# Altium schematic sheet Sheet2.SchDoc: FHGR_A3_landscape
size A3; Date: 18.07.2017; DrawnBy: G.P. Catregn; Organization: HTW Chur; Address1: Pulvermühlestrasse 57; Address2: 7004 Chur; Address3: Switzerland; DocumentNumber: 1; Revision: V1.0; SheetNumber: 2; SheetTotal: 2; DocumentName: HTW Template
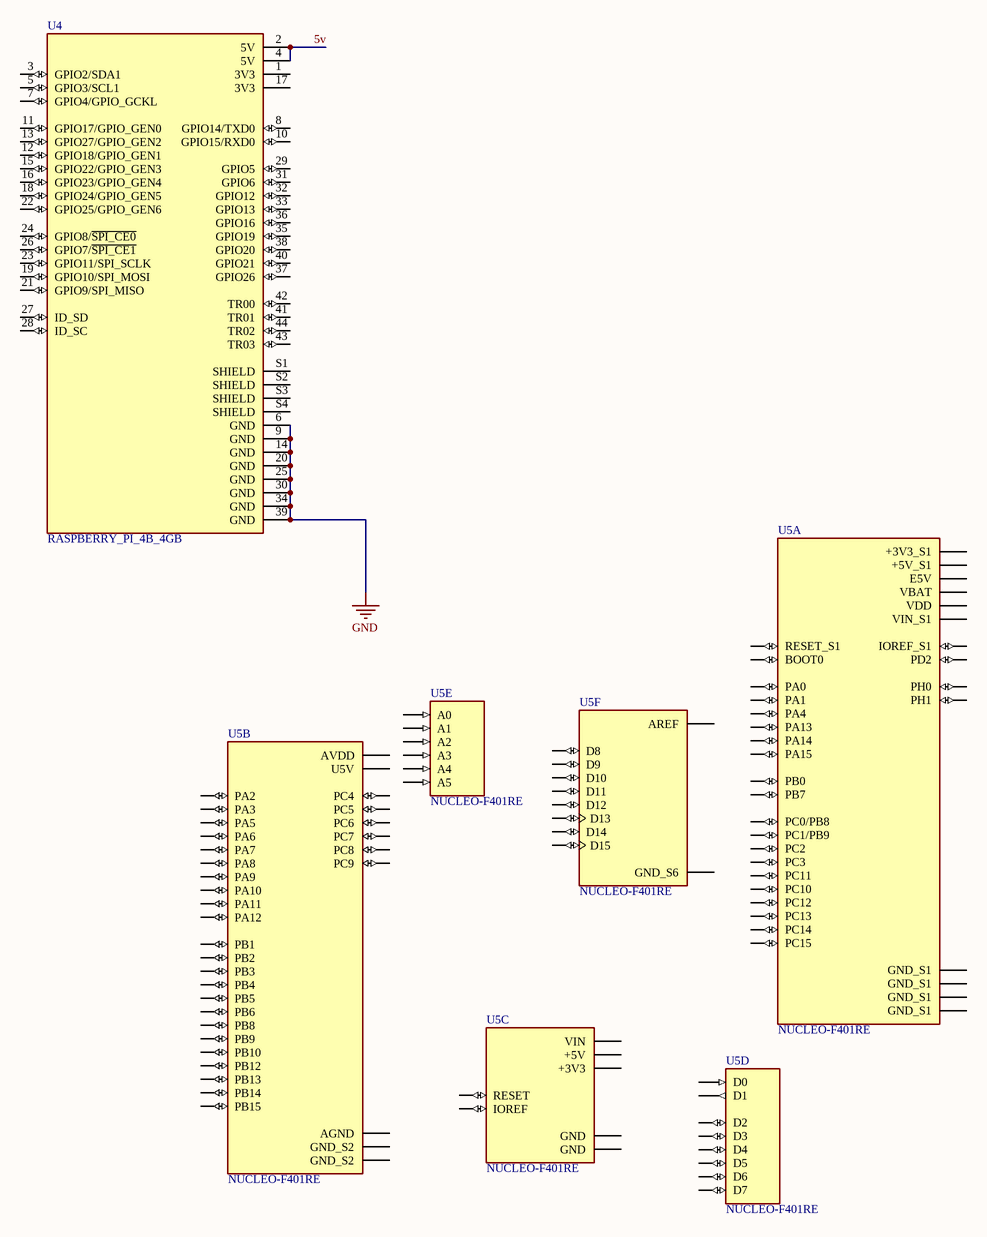
[diagram p0: Sheet2.SchDoc]

## Parts
U4  RASPBERRY_PI_4B_4GB  [MODULE_RASPBERRY_PI_4B_4GB]
U5  NUCLEO-F401RE  [ST_NUCLEO-F401RE]  (parts A,B,C,D,E,F of 6)

## Nets
GND: U4.6(GND) U4.9(GND) U4.14(GND) U4.20(GND) U4.25(GND) U4.30(GND) U4.34(GND) U4.39(GND)
5v: U4.2(5V) U4.4(5V)

Not connected (* = marked no-connect by the designer): U4 1(3V3) 3(GPIO2/SDA1) 5(GPIO3/SCL1) 7(GPIO4/GPIO_GCKL) 8(GPIO14/TXD0) 10(GPIO15/RXD0) 11(GPIO17/GPIO_GEN0) 12(GPIO18/GPIO_GEN1) 13(GPIO27/GPIO_GEN2) 15(GPIO22/GPIO_GEN3) 16(GPIO23/GPIO_GEN4) 17(3V3) 18(GPIO24/GPIO_GEN5) 19(GPIO10/SPI_MOSI) 21(GPIO9/SPI_MISO) 22(GPIO25/GPIO_GEN6) 23(GPIO11/SPI_SCLK) 24(GPIO8/~{SPI_CE0}) 26(GPIO7/~{SPI_CE1}) 27(ID_SD) 28(ID_SC) 29(GPIO5) 31(GPIO6) 32(GPIO12) 33(GPIO13) 35(GPIO19) 36(GPIO16) 37(GPIO26) 38(GPIO20) 40(GPIO21) 41(TR01) 42(TR00) 43(TR03) 44(TR02) S1(SHIELD) S2(SHIELD) S3(SHIELD) S4(SHIELD); U5 CN5_1(D8) CN5_2(D9) CN5_3(D10) CN5_4(D11) CN5_5(D12) CN5_6(D13) CN5_7(GND_S6) CN5_8(AREF) CN5_9(D14) CN5_10(D15) CN6_2(IOREF) CN6_3(RESET) CN6_4(+3V3) CN6_5(+5V) CN6_6(GND) CN6_7(GND) CN6_8(VIN) CN7_1(PC10) CN7_2(PC11) CN7_3(PC12) CN7_4(PD2) CN7_5(VDD) CN7_6(E5V) CN7_7(BOOT0) CN7_8(GND_S1) CN7_12(IOREF_S1) CN7_13(PA13) CN7_14(RESET_S1) CN7_15(PA14) CN7_16(+3V3_S1) CN7_17(PA15) CN7_18(+5V_S1) CN7_19(GND_S1) CN7_20(GND_S1) CN7_21(PB7) CN7_22(GND_S1) CN7_23(PC13) CN7_24(VIN_S1) CN7_25(PC14) CN7_27(PC15) CN7_28(PA0) CN7_29(PH0) CN7_30(PA1) CN7_31(PH1) CN7_32(PA4) CN7_33(VBAT) CN7_34(PB0) CN7_35(PC2) CN7_36(PC1/PB9) CN7_37(PC3) CN7_38(PC0/PB8) CN8_1(A0) CN8_2(A1) CN8_3(A2) CN8_4(A3) CN8_5(A4) CN8_6(A5) CN9_1(D0) CN9_2(D1) CN9_3(D2) CN9_4(D3) CN9_5(D4) CN9_6(D5) CN9_7(D6) CN9_8(D7) CN10_1(PC9) CN10_2(PC8) CN10_3(PB8) CN10_4(PC6) CN10_5(PB9) CN10_6(PC5) CN10_7(AVDD) CN10_8(U5V) CN10_9(GND_S2) CN10_11(PA5) CN10_12(PA12) CN10_13(PA6) CN10_14(PA11) CN10_15(PA7) CN10_16(PB12) CN10_17(PB6) CN10_19(PC7) CN10_20(GND_S2) CN10_21(PA9) CN10_22(PB2) CN10_23(PA8) CN10_24(PB1) CN10_25(PB10) CN10_26(PB15) CN10_27(PB4) CN10_28(PB14) CN10_29(PB5) CN10_30(PB13) CN10_31(PB3) CN10_32(AGND) CN10_33(PA10) CN10_34(PC4) CN10_35(PA2) CN10_37(PA3)

## Notes on the sheet
- Drawn by:
- Title:
- Date:
- Sheet
- of
- Size:
- Revision:
- A3
- File:

## Library data of the parts
U4 = CMP-052-000000-1: BCM2711 Raspberry Pi 4 Model B 4GB - ARMÂ® CortexÂ®-A72 MPU Embedded Evaluation Board; MP: RASPBERRY PI 4B/4GB; Design Item ID: RASPBERRY_PI_4B_4GB; Source: RASPBERRY_PI_4B_4GB.SchLib; MF: Raspberry Pi; Check_prices: https://www.snapeda.com/parts/RASPBERRY%20PI%204B/4GB/Raspberry+Pi/view-part/?ref=eda; SnapEDA_Link: https://www.snapeda.com/parts/RASPBERRY%20PI%204B/4GB/Raspberry+Pi/view-part/?ref=snap; Value: *; Purchase-URL: https://pricing.snapeda.com/search/part/RASPBERRY PI 4B/4GB/?ref=eda; Price: None; Availability: In Stock; Package: None; Component Type: Standard; Pin Count: 48
U5 = NUCLEO-F401RE: STM32 Nucleo-64 development board with STM32F401RET6 MCU, supports Arduino and ST morpho connectivity; Value: *; MP: NUCLEO-F401RE; Package: None; Availability: Unavailable; Price: None